# Altium schematic sheet sensordoline.SchDoc
size A
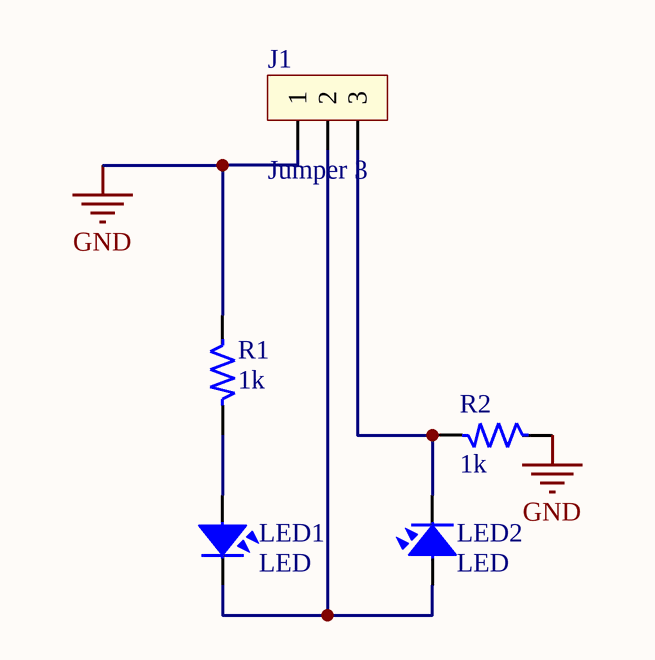
[diagram p0: sensordoline.SchDoc]

## Parts
J1  Jumper 3  [JP3]
LED1  LED  [LED-3]
LED2  LED  [LED-3]
R1  1k  [RES-SMD-0805]
R2  1k  [RES-SMD-0805]

## Nets
GND: J1.1 R1.1 R2.1
NetJ1_2: J1.2 LED1.2 LED2.1
NetJ1_3: J1.3 LED2.2 R2.2
NetLED1_1: LED1.1 R1.2

## Library data of the parts
J1 = JP3: Value: J3
LED1 LED2 = LED: LED Single colour Green and Red; Value: LED 3 ly Single Colour
R1 R2 = R: Resistor 1/4W; Value: R1/4W - 1K